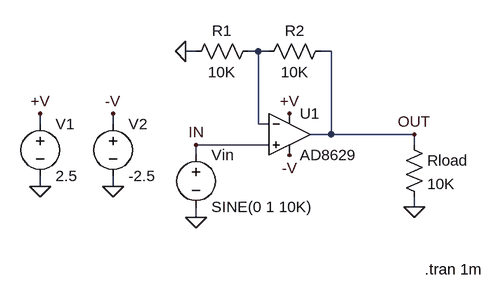
[diagram p0: schematic AD8629.asc]
AD8629.asc, the LTspice schematic file:
Version 4
SHEET 1 1240 700
WIRE 400 -1312 384 -1312
WIRE 496 -1312 480 -1312
WIRE 512 -1312 496 -1312
WIRE 608 -1312 592 -1312
WIRE 160 -1200 160 -1216
WIRE 272 -1200 272 -1216
WIRE 496 -1200 496 -1312
WIRE 512 -1200 496 -1200
WIRE 608 -1184 608 -1312
WIRE 608 -1184 576 -1184
WIRE 736 -1184 608 -1184
WIRE 512 -1168 400 -1168
WIRE 736 -1168 736 -1184
WIRE 400 -1152 400 -1168
WIRE 160 -1104 160 -1120
WIRE 272 -1104 272 -1120
WIRE 736 -1072 736 -1088
WIRE 400 -1056 400 -1072
FLAG 160 -1216 +V
FLAG 160 -1104 0
FLAG 400 -1056 0
FLAG 736 -1184 OUT
FLAG 400 -1168 IN
FLAG 544 -1216 +V
FLAG 272 -1216 -V
FLAG 544 -1152 -V
FLAG 384 -1312 0
FLAG 736 -1072 0
FLAG 272 -1104 0
SYMBOL Opamps\\AD8629 544 -1248 R0
SYMATTR InstName U1
SYMBOL voltage 160 -1216 R0
WINDOW 123 0 0 Left 2
WINDOW 39 0 0 Left 2
SYMATTR InstName V1
SYMATTR Value 2.5
SYMBOL voltage 400 -1168 R0
WINDOW 123 24 146 Left 2
WINDOW 39 24 125 Left 2
SYMATTR InstName Vin
SYMATTR Value SINE(0 1 10K)
SYMBOL res 496 -1328 R90
WINDOW 0 0 56 VBottom 2
WINDOW 3 32 56 VTop 2
SYMATTR InstName R1
SYMATTR Value 10K
SYMBOL res 608 -1328 R90
WINDOW 0 0 56 VBottom 2
WINDOW 3 32 56 VTop 2
SYMATTR InstName R2
SYMATTR Value 10K
SYMBOL voltage 272 -1216 R0
WINDOW 123 24 146 Left 2
WINDOW 39 24 125 Left 2
SYMATTR InstName V2
SYMATTR Value -2.5
SYMBOL res 720 -1184 R0
SYMATTR InstName Rload
SYMATTR Value 10K
TEXT 752 -976 Left 2 !.tran 1m

The netlist it stands for:
* AD8629.asc
XU1 IN N001 +V -V OUT AD8629  ; pins In+ In- V+ V- OUT
V1 +V 0 2.5
Vin IN 0 SINE(0 1 10K)
R1 N001 0 10K
R2 OUT N001 10K
V2 -V 0 -2.5
Rload OUT 0 10K
.tran 1m
.backanno
.end